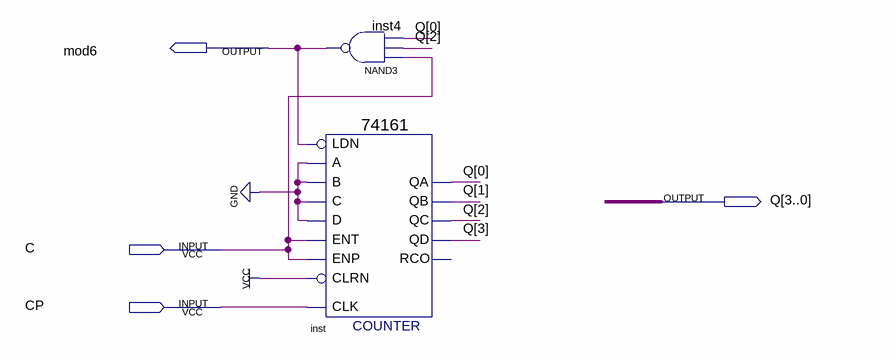
[diagram p0: schematic sheet]
// Quartus schematic mod6.bdf as structural Verilog: 2 symbols, 4 pins
module mod6 (
  input  C,
  input  CP,
  output mod6,
  output [3:0] Q
);

  nand inst4 (mod6, C, Q[2], Q[0]);
  \74161  inst (
    .CLRN(1'b1), .CLK(CP), .ENP(C), .LDN(mod6), .A(1'b0), .D(1'b0), .ENT(C), .B(1'b0), .C(1'b0), .QD(Q[3]),
    .QC(Q[2]), .QB(Q[1]), .QA(Q[0]));  // open: RCO
endmodule
